# EAGLE design Grove - Sunlight Sensor v1.0 (EAGLE 7.2.0)

## Sheet 1 of 2
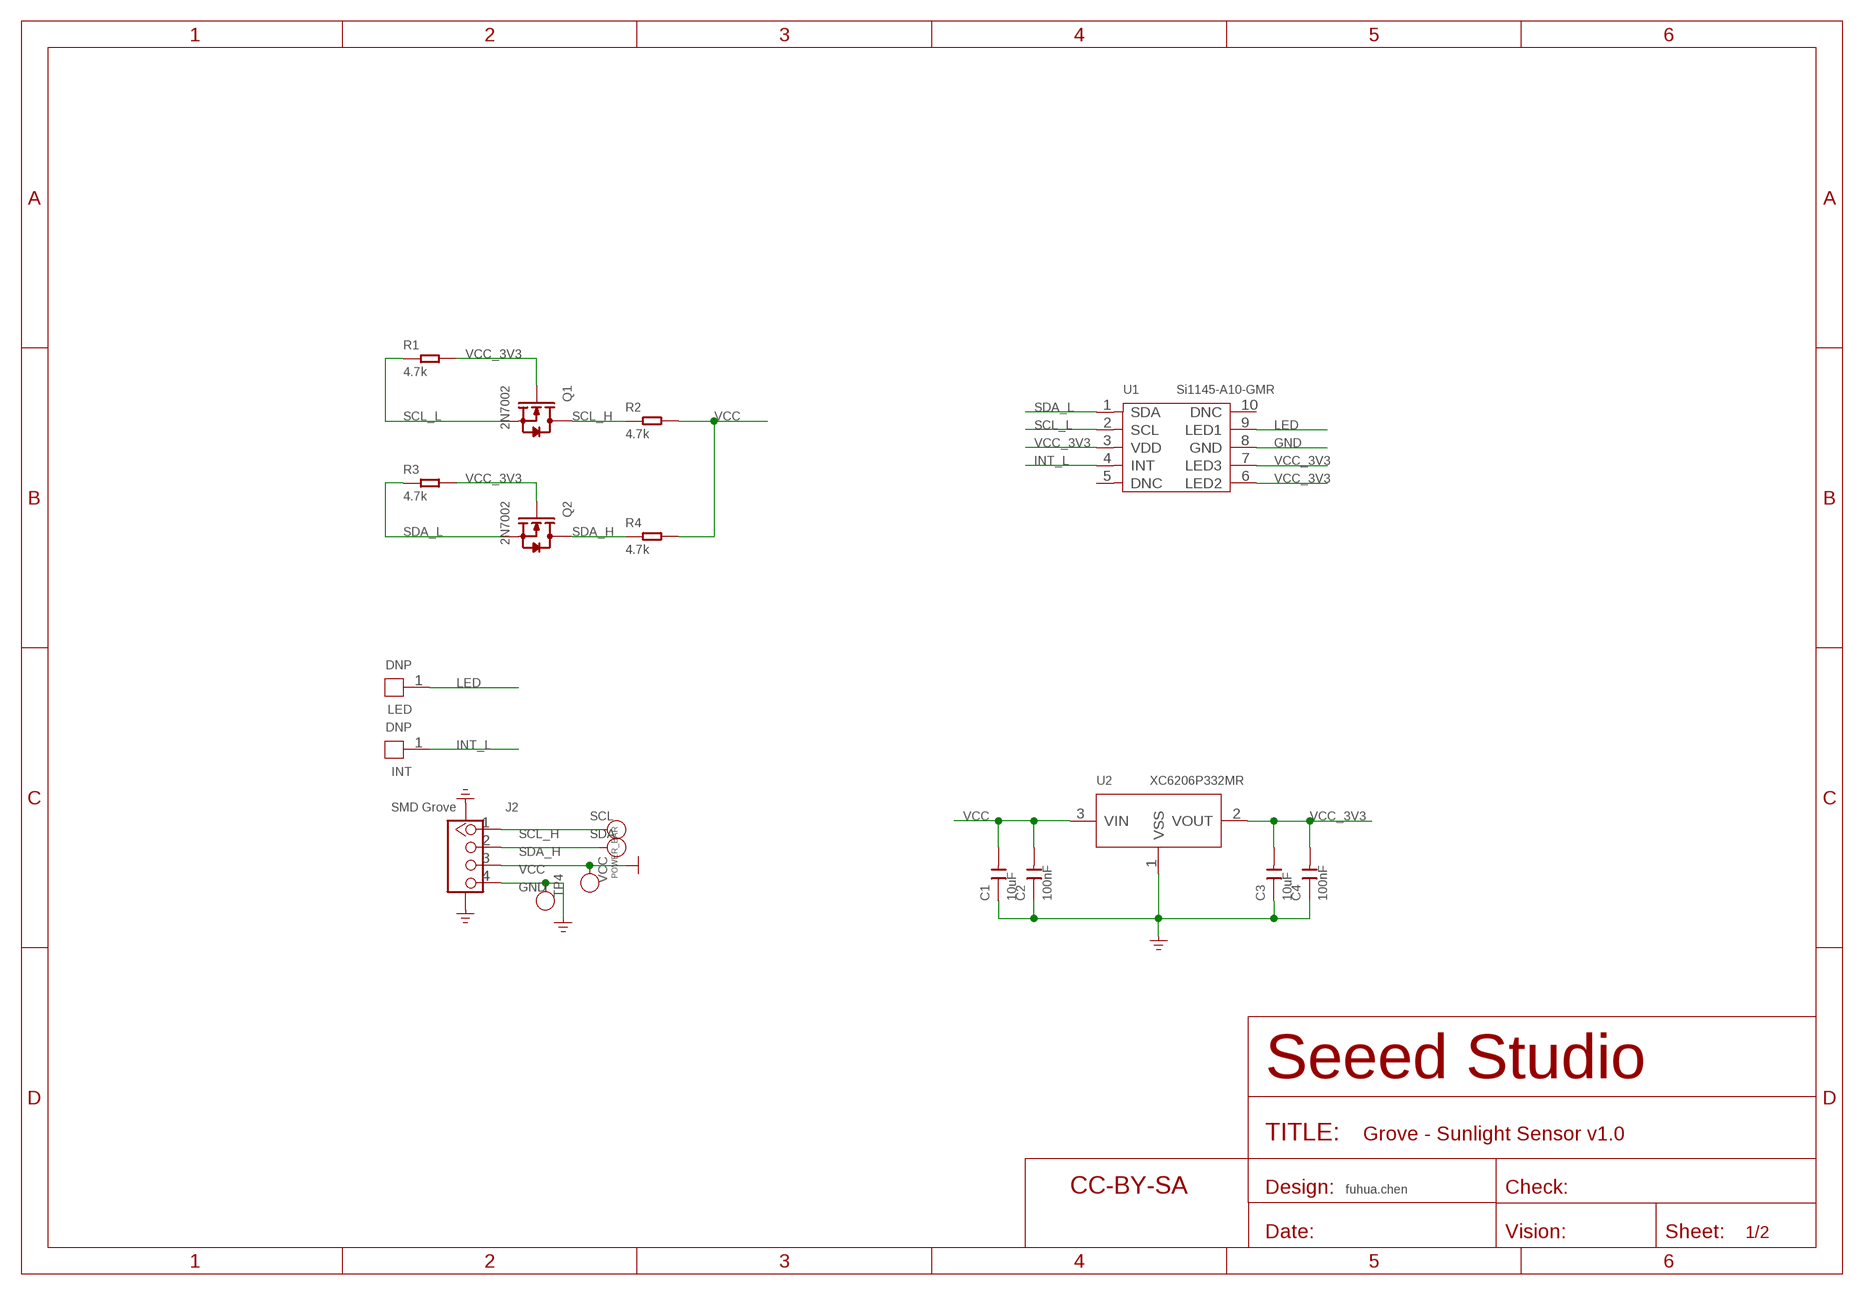
[diagram p0: schematic, sheet 1]

### Parts
C1  10uF  CAP-0603  [C0603]
C2  100nF  CAP-0603  [C0603]
C3  10uF  CAP-0603  [C0603]
C4  100nF  CAP-0603  [C0603]
FR  SEEEDSTUDIO-OPEN-SCH-FRAME  [SEEEDSTUDIO-PCB-FRAME]
INT  DNP  HEADER-1P-40  [1P-80/40MIL]
J2  SMD Grove  GROVE-CONNECTOR-SMD'DD'  [HW4-SMD-2.0]
LED  DNP  HEADER-1P-40  [1P-80/40MIL]
Q1  2N7002  MOSFET-N'SOT23'  [SOT-23]
Q2  2N7002  MOSFET-N'SOT23'  [SOT-23]
R1  4.7k  RES-0603  [R0603]
R2  4.7k  RES-0603  [R0603]
R3  4.7k  RES-0603  [R0603]
R4  4.7k  RES-0603  [R0603]
SCL  TEST-POINT'4545'  [TP-D45MIL]
SDA  TEST-POINT'4545'  [TP-D45MIL]
TP4  TEST-POINT'4545'  [TP-D45MIL]
U1  Si1145-A10-GMR  SENSOR-OPTICAL-SI1145/46/47  [DFN10-0.5-2X2MM]
U2  XC6206P332MR  PMIC-XC6206PMR  [SOT-23]
VCC  TEST-POINT'4545'  [TP-D45MIL]

### Nets
GND: C1.1 C2.1 C3.1 C4.1 J2.4 J2.SS1 J2.SS2 TP4.T U1.8(GND) U2.1(VSS) ; supply symbol labelled GND_POWER
INT_L: INT.1 U1.4(INT)
LED: LED.1 U1.9(LED1)
SCL_H: J2.1 Q1.3(D) R2.1 SCL.T
SCL_L: Q1.2(S) R1.1 U1.2(SCL)
SDA_H: J2.2 Q2.3(D) R4.1 SDA.T
SDA_L: Q2.2(S) R3.1 U1.1(SDA)
VCC: C1.2 C2.2 J2.3 R2.2 R4.2 U2.3(VIN) VCC.T ; supply symbol labelled POWER_BAR
VCC_3V3: C3.2 C4.2 Q1.1(G) Q2.1(G) R1.2 R3.2 U1.3(VDD) U1.6(LED2) U1.7(LED3) U2.2(VOUT)
Unconnected: U1.5(DNC) U1.10(DNC)

### Notes on the sheet
- fuhua.chen

## Sheet 2 of 2
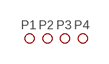
[diagram p1: schematic, sheet 2]

### Parts
P1  PAD-MARK'ANNULAR'  [ROUND-MARK-1.0]
P2  PAD-MARK'ANNULAR'  [ROUND-MARK-1.0]
P3  PAD-MARK'ANNULAR'  [ROUND-MARK-1.0]
P4  PAD-MARK'ANNULAR'  [ROUND-MARK-1.0]

## Library data of the parts
C1-C4 = Discrete-new:CAP: Ceramic Capacitors
FR = moudle-new:SEEEDSTUDIO-OPEN-SCH-FRAME
INT LED = Connector-new:HEADER-1P
J2 = Connector-new:GROVE-CONNECTOR-SMD: 4P-SMD-2.0:320110030;4P-SMD-2.0-90D:320110032
P1-P4 = Discrete-new:PAD-MARK; PARTNO: DNP
Q1 Q2 = Discrete-new:MOSFET-N
R1-R4 = Discrete-new:RES
SCL SDA TP4 VCC = Discrete-new:TEST-POINT; PARTNO: DNP
U1 = template:SENSOR-OPTICAL-SI1145/46/47
U2 = IC-new:PMIC-XC6206P: LOW ESR Cap.Compatible Positive Voltage Regulators

## Board
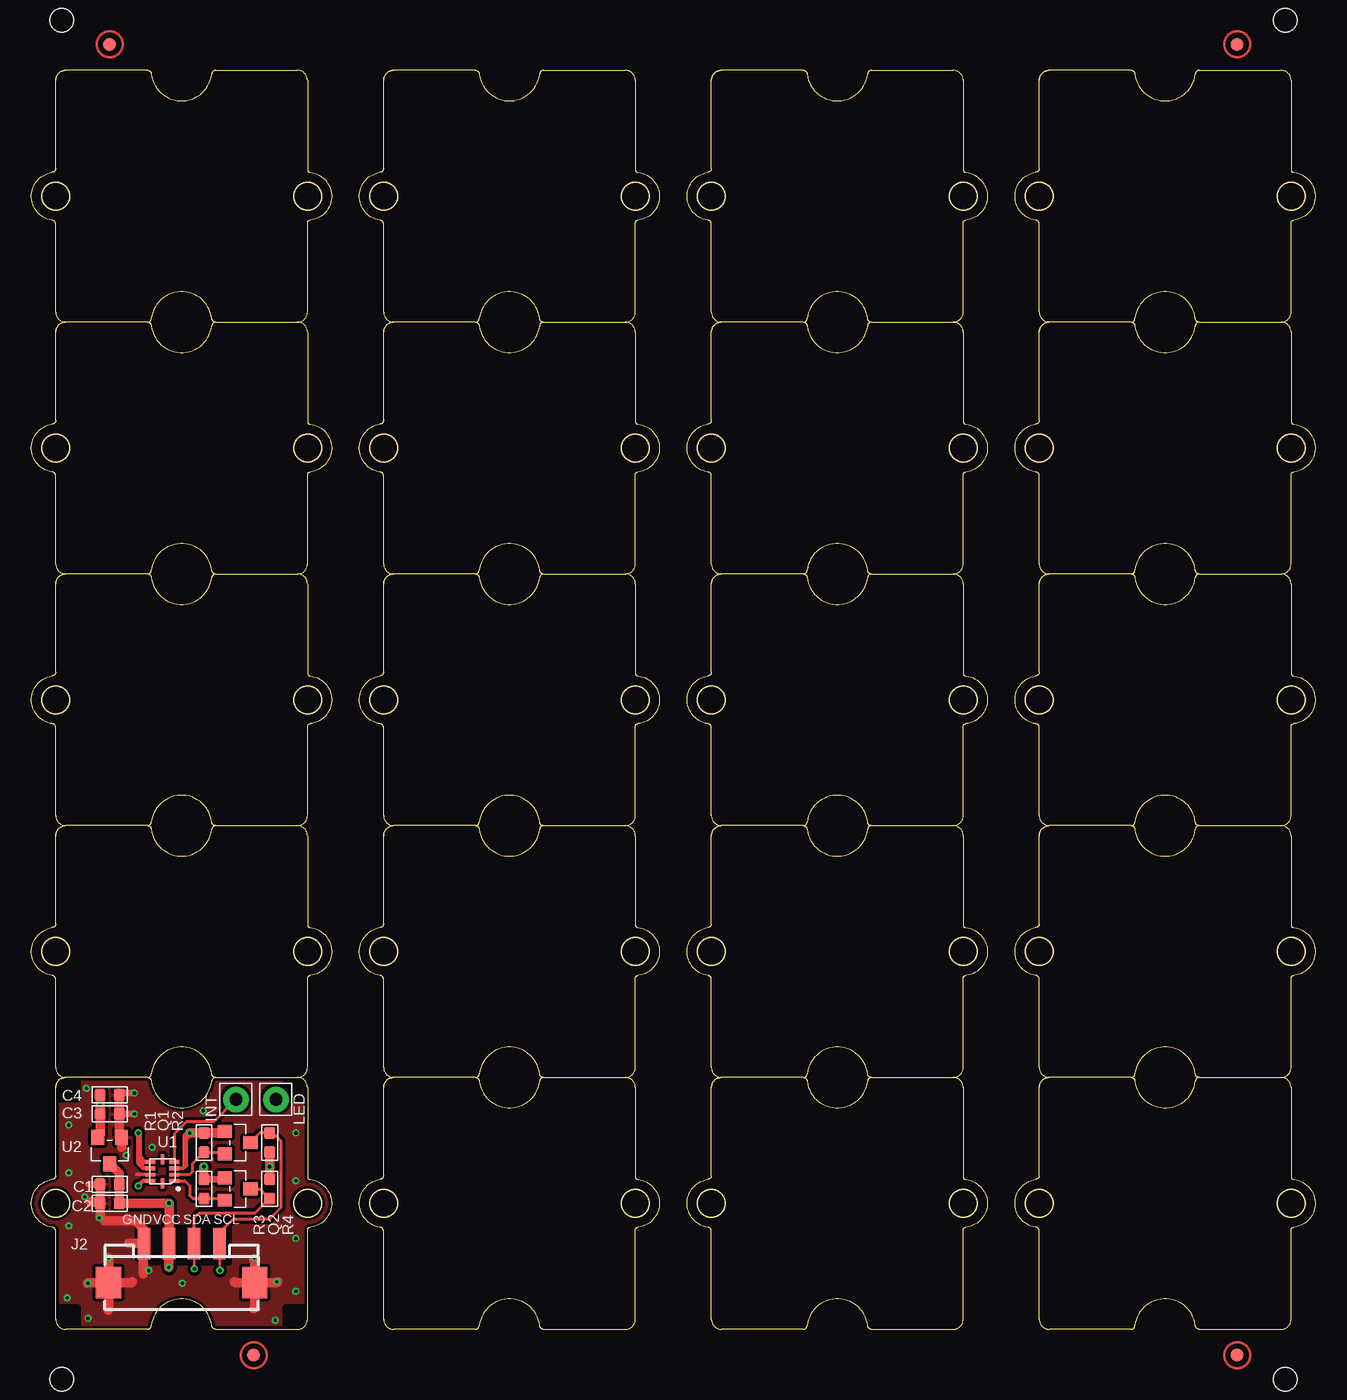
[diagram p2: board, top side]
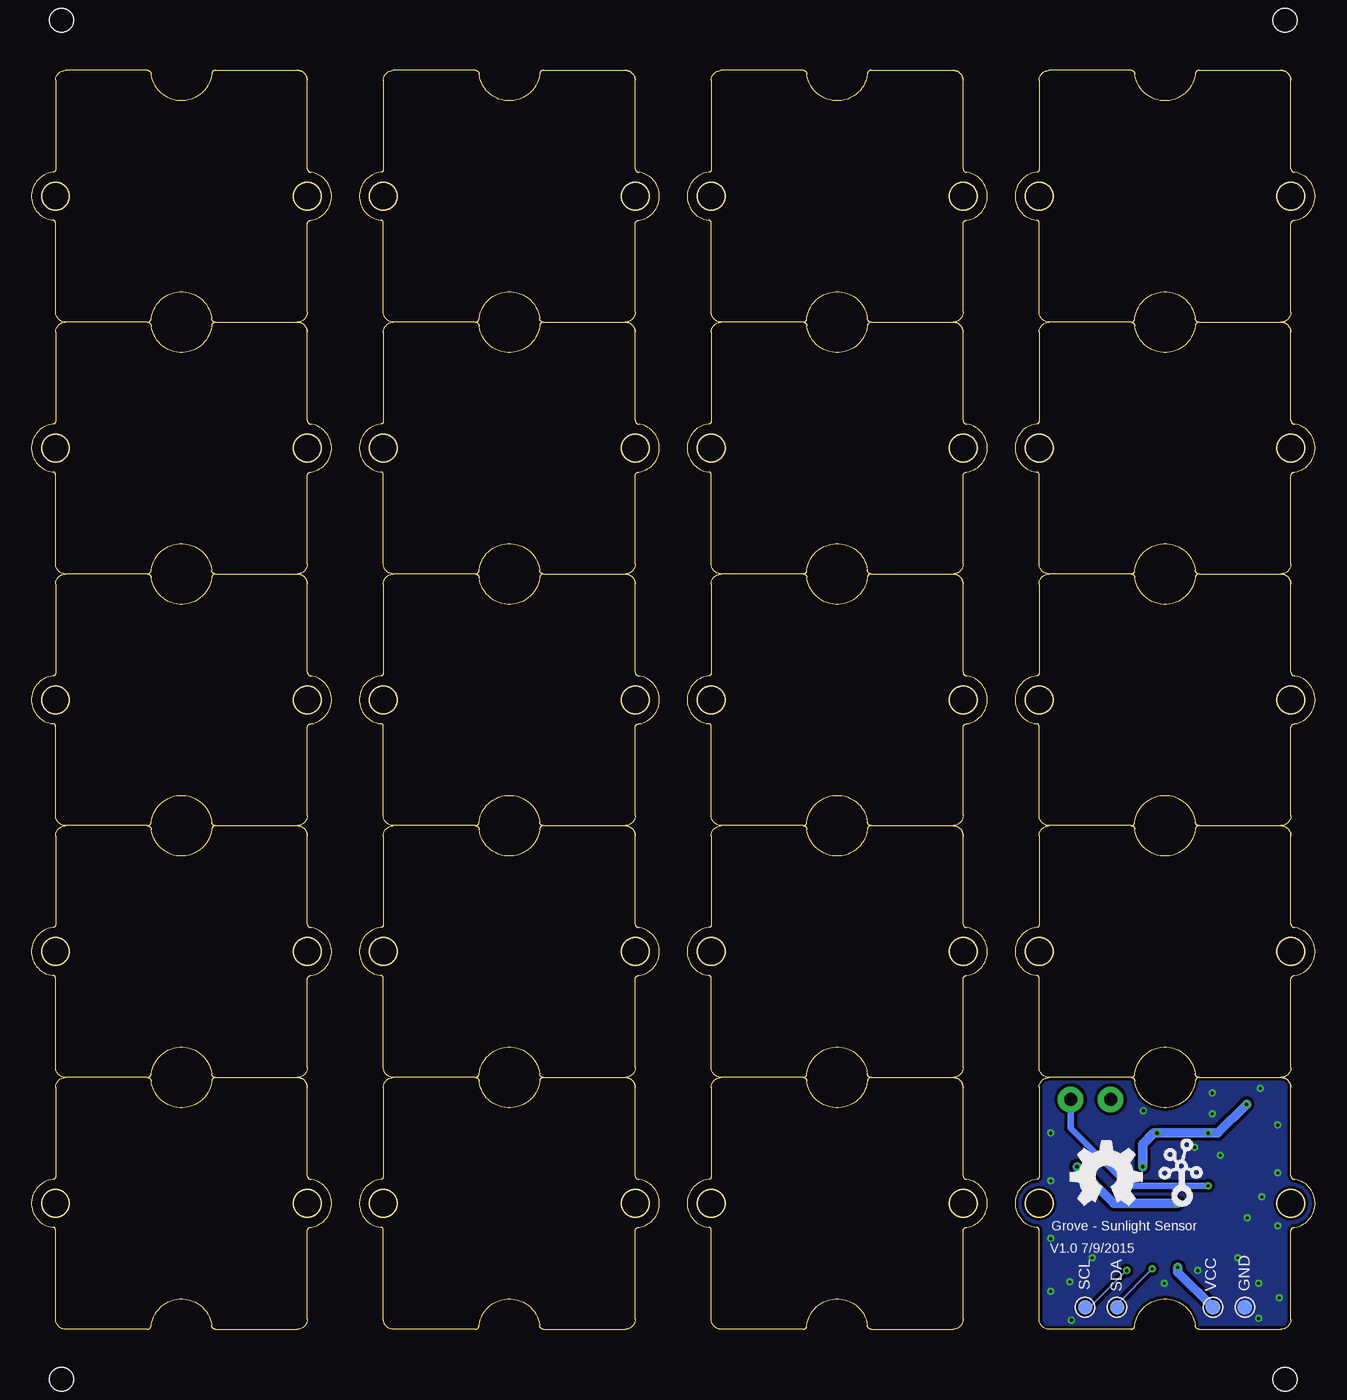
[diagram p3: board, bottom side, seen from below]

Size 101.93 x 100 mm. Coordinates in mm from the lower left corner, seen from the top.
Copper layers (1*16): Top 0.035mm / dielectric 1.5mm / Bottom 0.035mm
Design rules "SeeedStudio_2layer_DRU_no_angle_20140221 *": minimum track width 6mil, minimum drill 10mil, track to track 6mil, track to pad 6mil, pad to pad 6mil, via to via 6mil, smd to smd 0mil, copper to edge 10mil, drill to drill 10mil, minimum pad ring 10mil, minimum via ring 6mil, stop-mask expansion 2mil, vias tented up to drill 25mil, thermal gap 10mil
Holes 1.91 mm at 99.55,-3.97 2.4,-3.97 2.4,103.98 99.55,103.98

### Footprints (pad centres in the part's own frame; a part is rotated, then mirrored left to right if it is on the bottom)
C0603 = smd 0.889 x 0.889: 1 0,0.762; 2 0,-0.762
1P-80/40MIL = drill 1.016 pad 2.032: 1 0,0
HW4-SMD-2.0 = smd 1 x 2.5: 1 -3,0; 2 -1,0; 3 1,0; 4 3,0 | smd 2 x 2.5: SS1 -5.8,3.123; SS2 5.8,3.123
ROUND-MARK-1.0 = smd 1.016 x 1.016: P$1 0,0
SOT-23 = smd 1.016 x 1.143: 1 -0.889,-1.016; 2 0.889,-1.016; 3 0,1.016
R0603 = smd 0.889 x 0.889: 1 0,0.762; 2 0,-0.762
TP-D45MIL = smd 1.143 x 1.143: T 0,0
DFN10-0.5-2X2MM = smd 0.8 x 0.3: 1 -0.95,0.75; 2 -0.95,0.25; 3 -0.95,-0.25; 4 -0.95,-0.75; 6 0.95,-0.75; 7 0.95,-0.25; 8 0.95,0.25; 9 0.95,0.75 | smd 0.3 x 0.8: 5 0,-0.95; 10 0,0.95
SOT-23' = smd 1.016 x 1.2: 1 -0.95,-1.06; 2 0.95,-1.06; 3 0,1.06
GROVE-1*1-TEST-PLATFORM = hole 2.2: 0,-10; 0,10

### Placement (x,y rotation side)
C1  6.21,11.52 90 top
C2  6.21,10 90 top
C3  6.21,17.11 270 top
C4  6.21,18.64 270 top
FR  -0.14,-14.13 0 top  (outside the outline)
INT  16.24,18.25 0 top
J2  11.92,6.82 180 top
LED  19.41,18.25 0 top
P1  95.74,-2.06 90 top
P2  95.74,102.08 90 top
P3  17.64,-2.06 90 top
P4  6.21,102.08 90 top
Q1  16.37,14.83 270 top
Q2  16.37,11.14 270 top
R1  13.7,14.83 180 top
R2  18.91,14.83 0 top
R3  13.7,11.14 180 top
R4  18.91,11.14 180 top
SCL  18.27,1.75 0 bottom
SDA  15.73,1.75 0 bottom
TP4  5.57,1.75 0 bottom
U1  10.4,12.54 180 top
U2  XC6206P332MR  [SOT-23']  6.21,14.19 180 top
U$1  [GROVE-SILK-SMALL]  12.81,9.62 0 bottom
U$2  [GROVE-1*1-TEST-PLATFORM]  11.92,10 90 top
U$3  [OSHW_FILLX200_NOTEXT]  19.41,9.87 0 bottom
U$4  [GROVE-1*1-TEST-PLATFORM]  11.92,30 90 top
U$7  [GROVE-1*1-TEST-PLATFORM]  11.92,50 90 top
U$8  [GROVE-1*1-TEST-PLATFORM]  11.92,70 90 top
U$9  [GROVE-1*1-TEST-PLATFORM]  11.92,90 90 top
U$10  [GROVE-1*1-TEST-PLATFORM]  37.96,30 90 top
U$11  [GROVE-1*1-TEST-PLATFORM]  37.96,50 90 top
U$12  [GROVE-1*1-TEST-PLATFORM]  37.96,70 90 top
U$13  [GROVE-1*1-TEST-PLATFORM]  37.96,90 90 top
U$14  [GROVE-1*1-TEST-PLATFORM]  37.96,10 90 top
U$15  [GROVE-1*1-TEST-PLATFORM]  63.99,30 90 top
U$16  [GROVE-1*1-TEST-PLATFORM]  63.99,50 90 top
U$17  [GROVE-1*1-TEST-PLATFORM]  63.99,70 90 top
U$18  [GROVE-1*1-TEST-PLATFORM]  63.99,90 90 top
U$19  [GROVE-1*1-TEST-PLATFORM]  63.99,10 90 top
U$20  [GROVE-1*1-TEST-PLATFORM]  90.03,30 90 top
U$21  [GROVE-1*1-TEST-PLATFORM]  90.03,50 90 top
U$22  [GROVE-1*1-TEST-PLATFORM]  90.03,70 90 top
U$23  [GROVE-1*1-TEST-PLATFORM]  90.03,90 90 top
U$24  [GROVE-1*1-TEST-PLATFORM]  90.03,10 90 top
VCC  8.11,1.75 0 bottom

### Tracks (layer width: path | path; a pad name or v marks a point on that pad's centre or on a via)
GND  (via drill 0.25 pad 0.51)
  Top 0.279: U1.8 8.37,12.29
  Top 0.305: C1.1 5.44,11.78
  Top 0.508: v8.18,18.76 7.1,18.76 C4.1 | v8.18,17.11 C3.1 | C1.1 4.56,11.52
  Top 0.762: 5.44,10.13 C2.1 5.44,8.98 5.83,8.6 8.24,8.6 8.92,7.92 J2.4 | 5.44,10.13 C1.1 | C4.1 C3.1 6.97,15.44 U2.1 7.16,14.45 | 5.44,10.13 4.68,10.13 | J2.4 7.73,6.82 | J2.4 8.87,6.78 8.87,4.41 | J2.SS2 6.12,5.64 6.08,5.68 | J2.SS2 4.48,3.7 4.43,3.65 | J2.SS2 7.91,3.7 7.98,3.78 | J2.SS2 6.12,1.53 6.08,1.49 | J2.SS1 17.72,5.47 17.64,5.55 | J2.SS1 19.47,3.7 19.54,3.78 | J2.SS1 16.19,3.7 16.11,3.78 | J2.SS1 17.72,1.7 17.64,1.62
  other vias: 4.24,10.51 7.54,13.81 21,15.59 4.36,19.14 2.97,16.22 4.49,0.86 4.49,3.65 6.14,5.68 9.32,4.67 19.48,3.78 17.7,5.68 9.57,14.45 13.64,17.37 21,11.78 21,7.21 21,3.02 19.35,0.73 11.98,3.65 2.84,2.51 5.38,8.86 2.97,8.22 2.97,12.41
  pour Top (isolate 0.254, rank 6): 0.11,19.91 23.99,19.91 23.99,-0.29 0.11,-0.29
  pour Bottom (isolate 0.254, rank 6): 1.63,20.03 23.99,19.65 23.99,-0.54 0.11,-0.16 0.11,20.03
INT_L
  Top 0.254: U1.4 11.35,15.52 12.3,16.48 14.46,16.48 INT.1
LED  (via drill 0.25 pad 0.51)
  Top 0.305: U1.9 8.89,11.79 v8.49,11.4
  Bottom 0.508: LED.1 19.41,15.97 14.84,11.4 v8.49,11.4
N$1
  cutout Top: 8.75,7.59 8.75,5.17 14.97,5.17 15.86,5.17 15.86,6.7 15.86,8.22 8.75,8.22
SCL_H  (via drill 0.25 pad 0.51)
  Top 0.203: J2.1 14.97,6.78 v14.97,4.67
  Top 0.254: Q1.3 18.14,15.59 R2.1 19.16,15.59 19.8,14.95 19.8,9.65 18.88,8.73 15.99,8.73 14.92,7.67 J2.1
  Bottom 0.203: v14.97,4.67 17.89,1.75 SCL.T
SCL_L
  Top 0.254: U1.2 12.56,12.29 12.81,12.54 12.81,13.18 R1.1 15.22,14.06 Q1.2
SDA_H  (via drill 0.25 pad 0.51)
  Top 0.203: J2.2 12.94,6.81 v12.94,4.79
  Top 0.254: Q2.3 18.14,11.14 R4.1 17.76,9.24 13.32,9.24 12.92,8.84 J2.2
  Bottom 0.203: v12.94,4.79 15.73,2 SDA.T
SDA_L
  Top 0.254: U1.1 12.16,11.79 12.56,11.4 12.56,10.64 12.81,10.38 R3.1 15.22,10.38 Q2.2
VCC  (via drill 0.25 pad 0.51)
  Top 0.762: U2.3 6.97,12.37 C1.2 C2.2 6.98,10.02 v10.92,10.02 J2.3 10.91,6.81 v10.91,4.92 | R2.2 v18.91,12.92 R4.2
  Bottom 0.762: v10.92,10.02 16,10.02 v18.91,12.92 | v10.91,4.92 10.91,4.54 VCC.T
VCC_3V3  (via drill 0.25 pad 0.51)
  Top 0.254: 15.22,11.91 Q2.1
  Top 0.279: U1.3 12.04,12.79 12.18,12.92
  Top 0.305: U1.7 8.88,12.79 8.76,12.91 | 8.76,12.91 8.49,13.18 8.49,13.56 | 8.49,13.56 v8.49,15.59 8.62,15.46 8.62,13.68 8.99,13.31 8.99,13.29 | U1.6 8.99,13.29 | 8.99,13.29 8.76,13.29 | 8.76,13.29 8.49,13.56 | 12.18,15.21 12.18,12.92 12.3,13.05 12.3,15.08 12.68,15.46 | 12.18,15.21 v12.56,15.59 | 8.76,13.29 8.76,12.91 | 12.18,15.21 12.18,15.46 12.43,15.71
  Top 0.508: 15.22,11.91 R3.2
  Top 0.762: U2.2 5.44,15.44 C3.2 v5.44,17.87 C4.2 | Q1.1 15.22,15.59 R1.2 v12.56,15.59 | R3.2 v13.7,12.92
  Bottom 0.762: v13.7,12.92 13.7,14.7 12.81,15.59 v12.56,15.59 v8.49,15.59 7.73,15.59 v5.44,17.87

### Text on the board
tPlace: GND | VCC | SDA | SCL
bPlace: Grove - Sunlight Sensor | V1.0 7/9/2015 | GND